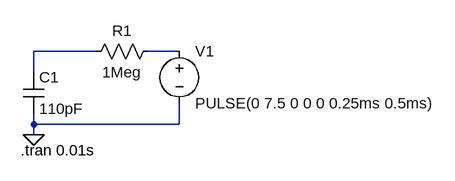
[diagram p0: schematic Gate capacitance test.asc]
Gate capacitance test.asc, the LTspice schematic file:
Version 4
SHEET 1 880 680
WIRE 272 96 176 96
WIRE 400 96 352 96
WIRE 176 128 176 96
WIRE 176 208 176 192
WIRE 400 208 400 176
WIRE 400 208 176 208
WIRE 176 224 176 208
FLAG 176 224 0
SYMBOL cap 160 128 R0
SYMATTR InstName C1
SYMATTR Value 110pF
SYMBOL res 368 80 R90
WINDOW 0 0 56 VBottom 2
WINDOW 3 32 56 VTop 2
SYMATTR InstName R1
SYMATTR Value 1Meg
SYMBOL voltage 400 80 R0
WINDOW 123 0 0 Left 0
WINDOW 39 0 0 Left 0
SYMATTR InstName V1
SYMATTR Value PULSE(0 7.5 0 0 0 0.25ms 0.5ms)
TEXT 156 248 Left 2 !.tran 0.01s

The netlist it stands for:
* Gate capacitance test.asc
C1 N001 0 110pF
R1 N002 N001 1Meg
V1 N002 0 PULSE(0 7.5 0 0 0 0.25ms 0.5ms)
.tran 0.01s
.backanno
.end